# EAGLE design ADM3260_Breakout (EAGLE 9.2.2)
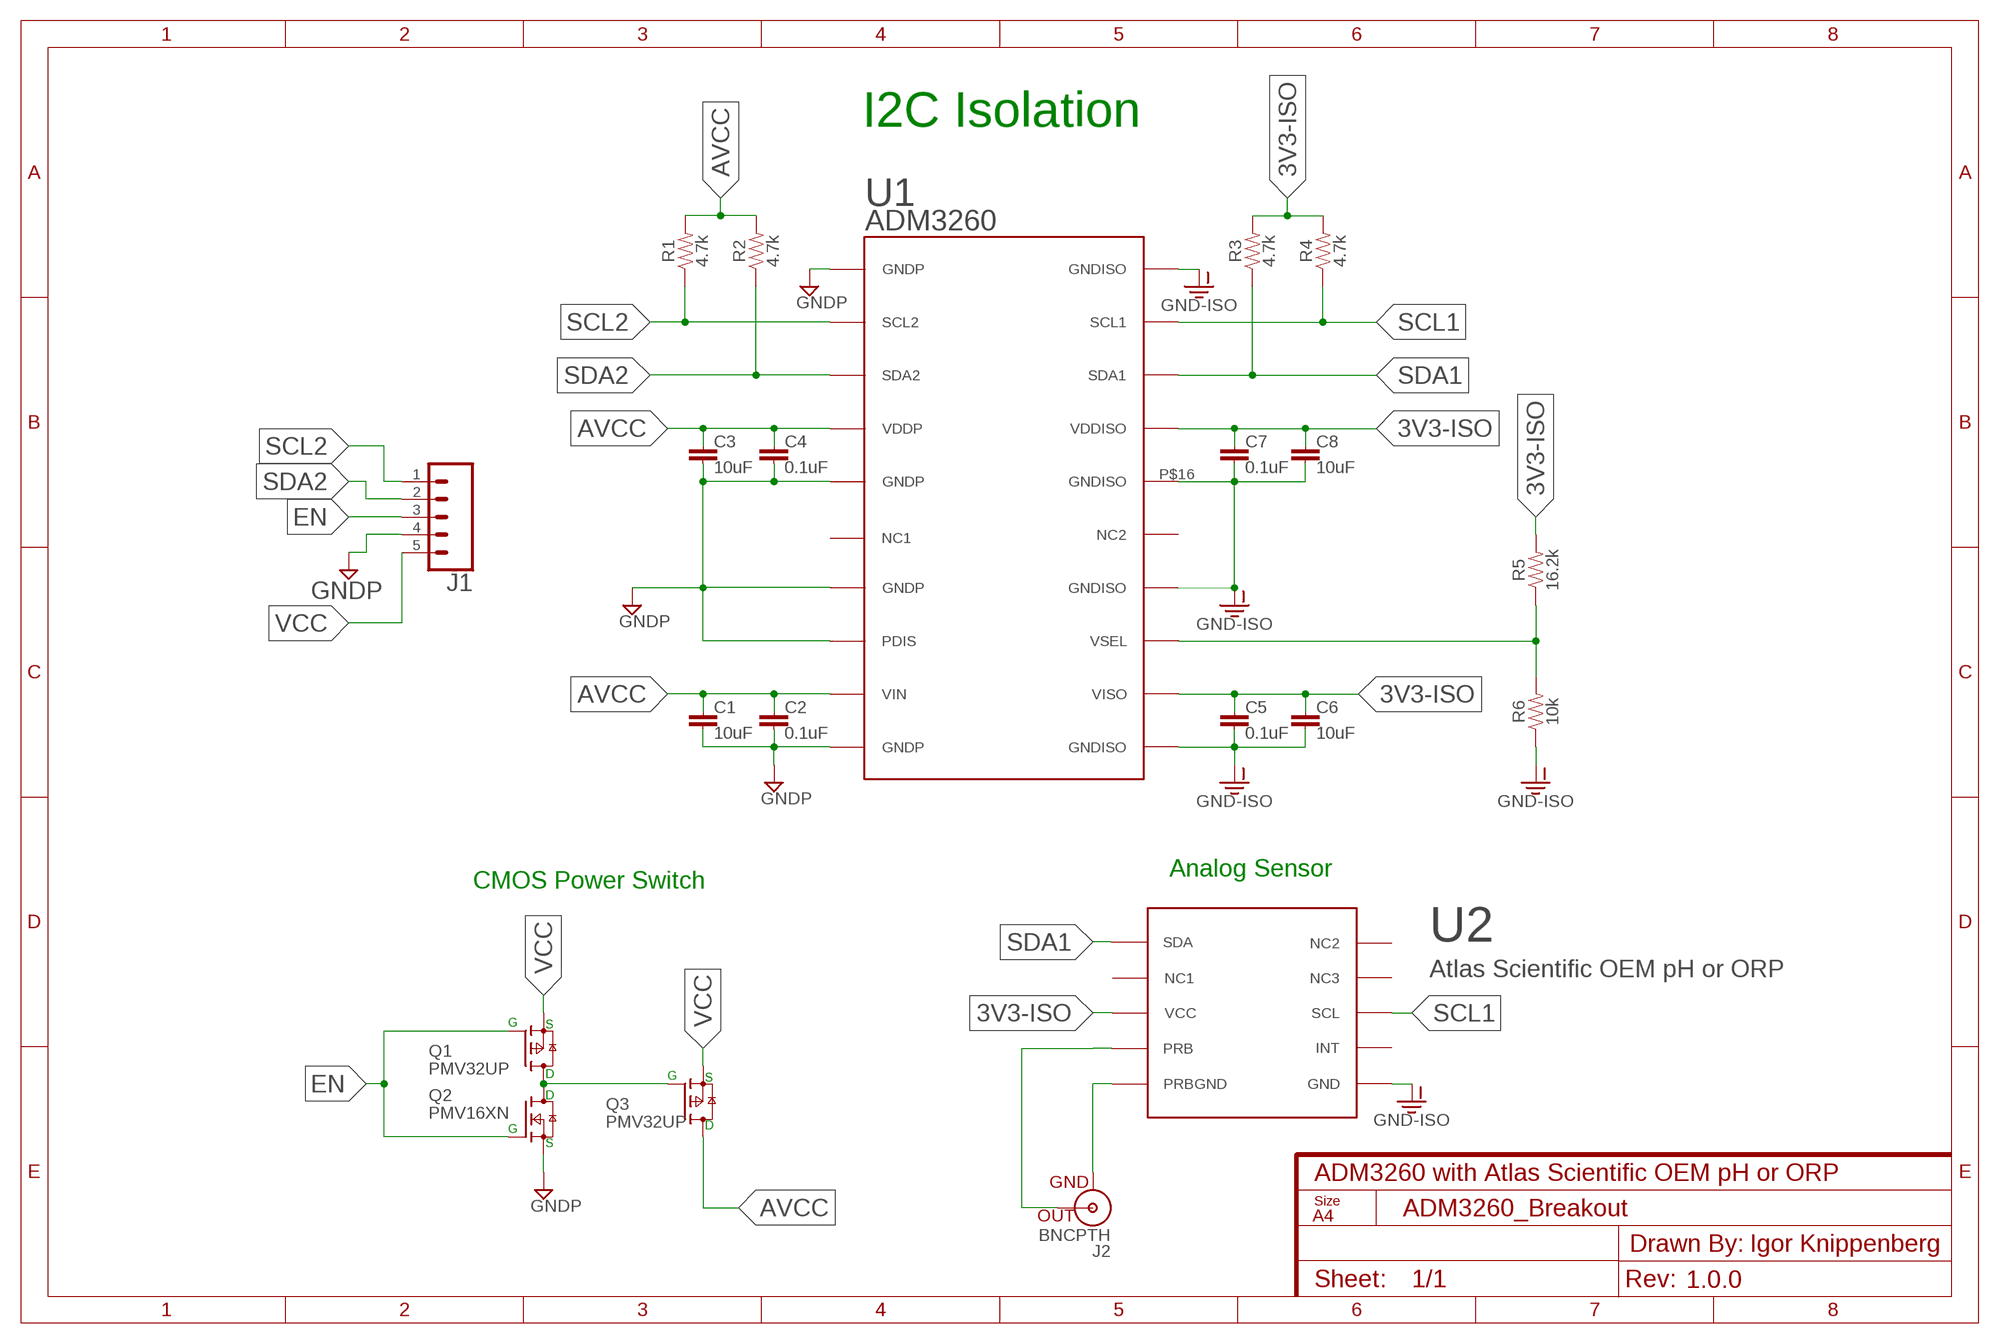
[diagram p0: schematic, sheet 1]
FRAME1 (FRAME-A4L): CNAME: ADM3260 with Atlas Scientific OEM pH or ORP; CREVISION: 1.0.0; DESIGNER: Igor Knippenberg

## Parts
C1  10uF  10UF-0805-10V-10%  [0805]
C2  0.1uF  0.1UF-0603-25V-(+80/-20%)  [0603]
C3  10uF  10UF-0805-10V-10%  [0805]
C4  0.1uF  0.1UF-0603-25V-(+80/-20%)  [0603]
C5  0.1uF  0.1UF-0603-25V-(+80/-20%)  [0603]
C6  10uF  10UF-0805-10V-10%  [0805]
C7  0.1uF  0.1UF-0603-25V-(+80/-20%)  [0603]
C8  10uF  10UF-0805-10V-10%  [0805]
J1  CONN_05LOCK_LONGPADS  [1X05_LOCK_LONGPADS]
J2  BNCPTH  [BNC]
Q1  PMV32UP  BSS84  [SOT23]
Q2  PMV16XN  BSH105  [SOT23]
Q3  PMV32UP  BSS84  [SOT23]
R1  4.7k  4.7KOHM-0603-1/10W-1%  [0603]
R2  4.7k  4.7KOHM-0603-1/10W-1%  [0603]
R3  4.7k  4.7KOHM-0603-1/10W-1%  [0603]
R4  4.7k  4.7KOHM-0603-1/10W-1%  [0603]
R5  16.2k  16.2KOHM-0603-1/10W-1%  [0603]
R6  10k  10KOHM-0603-1/10W-1%  [0603]
U1  ADM3260  [ADM3260]
U2  Atlas Scientific OEM pH or ORP  PHSENSOR  [PHSENSOR]

## Nets
3V3-ISO: C5.1 C6.1 C7.1 C8.1 R3.2 R4.2 R5.2 U1.P$12(VISO) U1.P$17(VDDISO) U2.P$3(VCC)
AVCC: C1.1 C2.1 C3.1 C4.1 Q3.3(D) R1.2 R2.2 U1.P$4(VDDP) U1.P$9(VIN)
EN: J1.3 Q1.1(G) Q2.1(G)
GND: C1.2 C2.2 C3.2 C4.2 J1.4 Q2.2(S) U1.P$1(GNDP) U1.P$5(GNDP) U1.P$7(GNDP) U1.P$8(PDIS) U1.P$10(GNDP) ; supply symbol labelled GNDP
GND-ISO: C5.2 C6.2 C7.2 C8.2 R6.1 U1.P$11(GNDISO) U1.P$14(GNDISO) U1.P$16(GNDISO) U1.P$20(GNDISO) U2.P$6(GND)
N$1: R5.1 R6.2 U1.P$13(VSEL)
N$2: Q1.3(D) Q2.3(D) Q3.1(G)
PRB: J2.S(OUT) U2.P$4(PRB)
PRBGND: J2.GND U2.P$5(PRBGND)
SCL1: R4.1 U1.P$19(SCL1) U2.P$8(SCL)
SCL2: J1.1 R1.1 U1.P$2(SCL2)
SDA1: R3.1 U1.P$18(SDA1) U2.P$1(SDA)
SDA2: J1.2 R2.1 U1.P$3(SDA2)
VCC: J1.5 Q1.2(S) Q3.2(S)
Unconnected: U1.P$6(NC1) U1.P$15(NC2) U2.P$2(NC1) U2.P$7(INT) U2.P$9(NC3) U2.P$10(NC2)

## Notes on the sheet
- I2C Isolation
- Analog Sensor
- CMOS Power Switch
- G | S
- D | G
- S
- D
- D
- G
- S

## Library data of the parts
C1 C3 C6 C8 = SparkFun-Capacitors:10UF: 10.0µF ceramic capacitors A capacitor is a passive two-terminal electrical component used to store electrical energy temporarily in an electric field.; PROD_ID: CAP-11330
C2 C4 C5 C7 = SparkFun-Capacitors:0.1UF: 0.1µF ceramic capacitors A capacitor is a passive two-terminal electrical component used to store electrical energy temporarily in an electric field.; PROD_ID: CAP-00810
J1 = SparkFun-Connectors:CONN_05: Multi connection point. Often used as Generic Header-pin footprint for 0.1 inch spaced/style header connections On any of the 0.1 inch spaced packages, you can populate with these: Break Away Headers - Straight <https://www.sparkfun.com/products/116> (PRT-00116) Break Away Male Headers - Right Angle <https://www.sparkfun.com/products/553> (PRT-00553) Female Headers <https://www.sparkfun.com/products/115> (PRT-00115) Break Away Headers - Machine Pin <https://www.sparkfun.com/products/117> (PRT-00117) Break Away Female Headers - Swiss Machine Pin <https://www.sparkfun.com/products/743> (PRT-00743) For SCREWTERMINALS and SPRING TERMINALS visit here: Screw Terimnals on SparkFun.com <https://www.sparkfun.com/search/results?term=Screw+Terminals> (5mm/3.5mm/2.54mm spacing) This device is also useful as a general connection point to wire up your design to another part of your project. Our various solder wires solder well into these plated through hole pads. Hook-Up Wire - Assortment (Stranded, 22 AWG) <https://www.sparkfun.com/products/11375> (PRT-11375) Hook-Up Wire - Assortment (Solid Core, 22 AWG) <https://www.sparkfun.com/products/11367> (PRT-11367) View the entire wire category on our website here <https://www.sparkfun.com/categories/141> Special notes: Molex polarized connector foot print use with SKU : PRT-08231 with associated crimp pins and housings. 1MM SMD Version SKU: PRT-10208
J2 = SparkFun-Connectors:BNC: BNC Right Angle Connector Mouser Part# 5227161 SparkFun Products: BNC Connector - Right Angle <https://www.sparkfun.com/products/10550>; PROD_ID: LPA-12729; SF_ID: PRT-10550
Q1 Q3 = nxp_60:BSS84: P-channel enhancement mode vertical DMOS transistor P-channel enhancement mode vertical Diffusion Metal-Oxide Semiconductor (DMOS) transistor in a small Surface-Mounted Device (SMD) plastic package. AAL Eindhoven MK
Q2 = nxp_60:BSH105: N-channel enhancement mode MOS transistor
R1-R4 = SparkFun-Resistors:4.7KOHM: 4.7kΩ resistor A resistor is a passive two-terminal electrical component that implements electrical resistance as a circuit element. Resistors act to reduce current flow, and, at the same time, act to lower voltage levels within circuits. - Wikipedia; PROD_ID: RES-07857
R5 = SparkFun-Resistors:16.2KOHM: 16.2kΩ resistor A resistor is a passive two-terminal electrical component that implements electrical resistance as a circuit element. Resistors act to reduce current flow, and, at the same time, act to lower voltage levels within circuits. - Wikipedia; PROD_ID: RES-12187
R6 = SparkFun-Resistors:10KOHM: 10kΩ resistor A resistor is a passive two-terminal electrical component that implements electrical resistance as a circuit element. Resistors act to reduce current flow, and, at the same time, act to lower voltage levels within circuits. - Wikipedia; PROD_ID: RES-00824
U1 = analog-devices:ADM3260: ADM3260 - I2C Isolator with DCDC Converter
U2 = SENSOR:PHSENSOR: pH OEM - Atlas Scientific pH Sensor Technical Specifications: Reads: pH Range: .001-14.000 Max rate: 1 reading every 420ms Operating Voltage: 3.3V - 5V

## Board
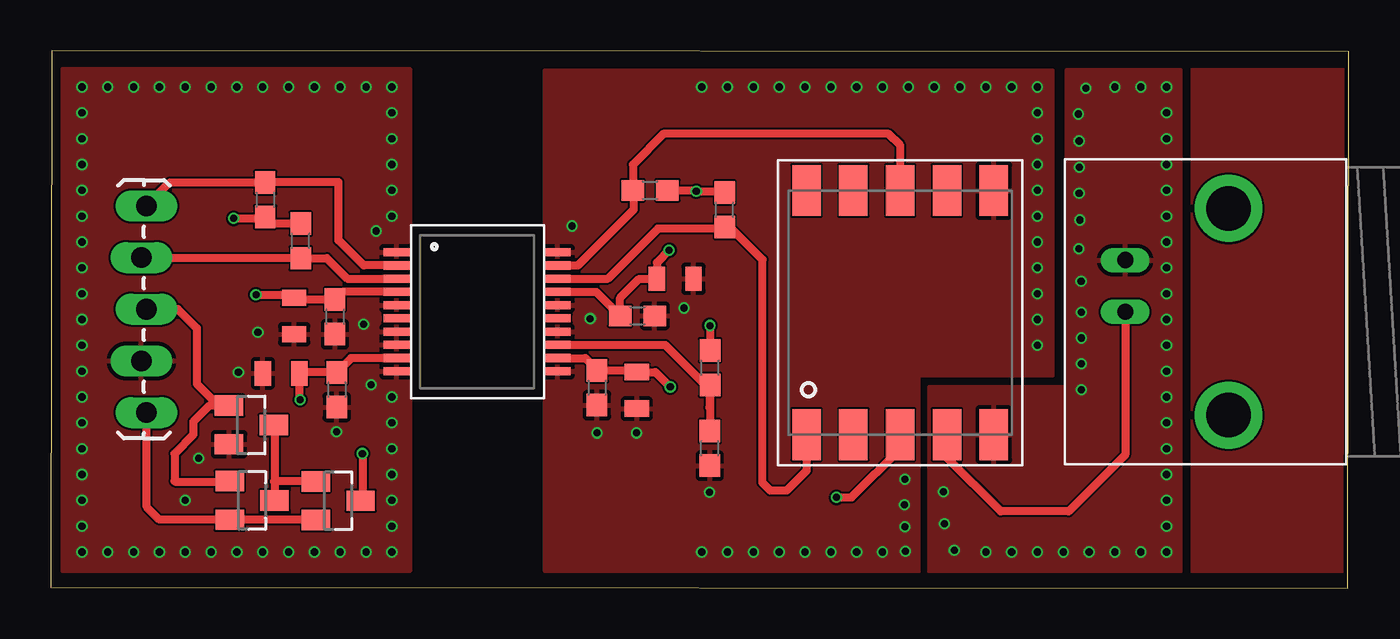
[diagram p1: board, top side]
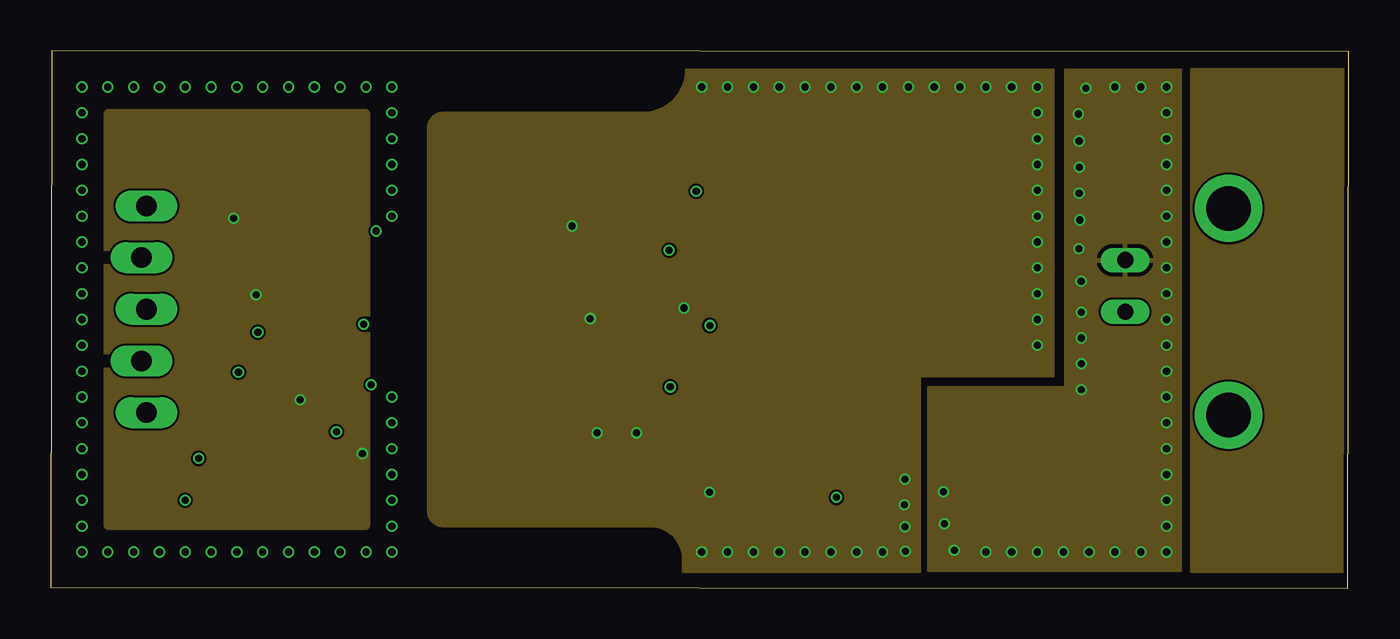
[diagram p2: board, inner layer Route2]
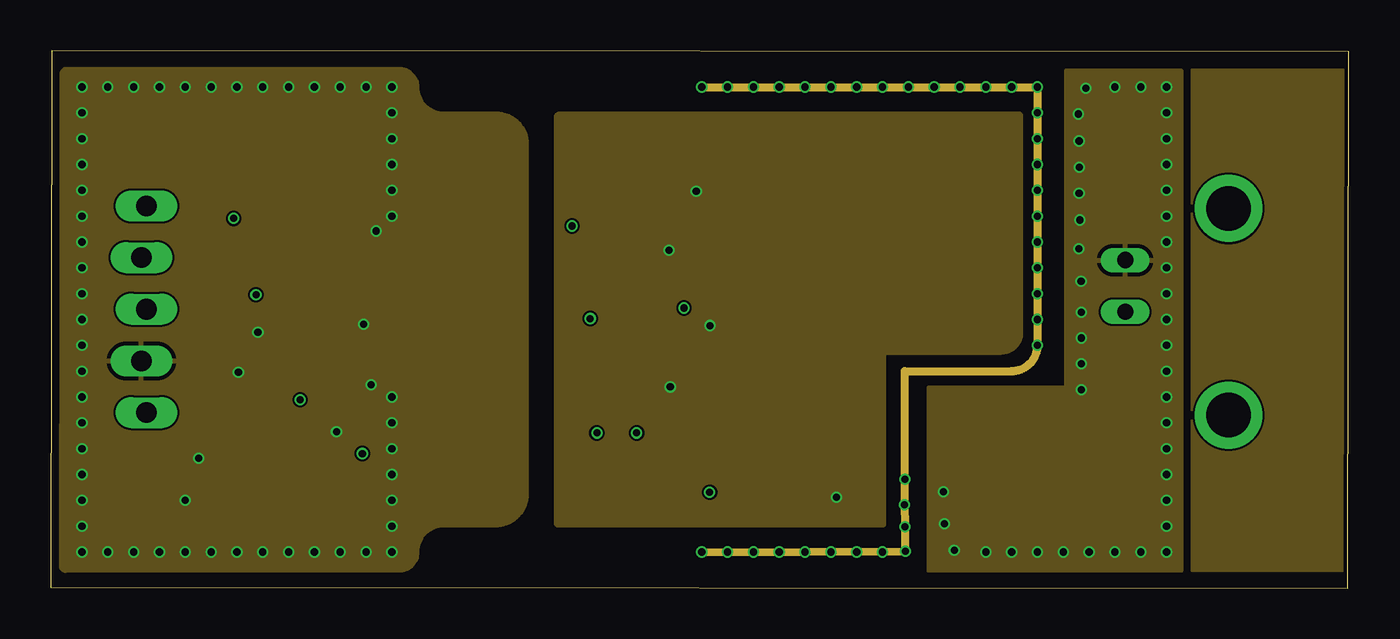
[diagram p3: board, inner layer Route3]
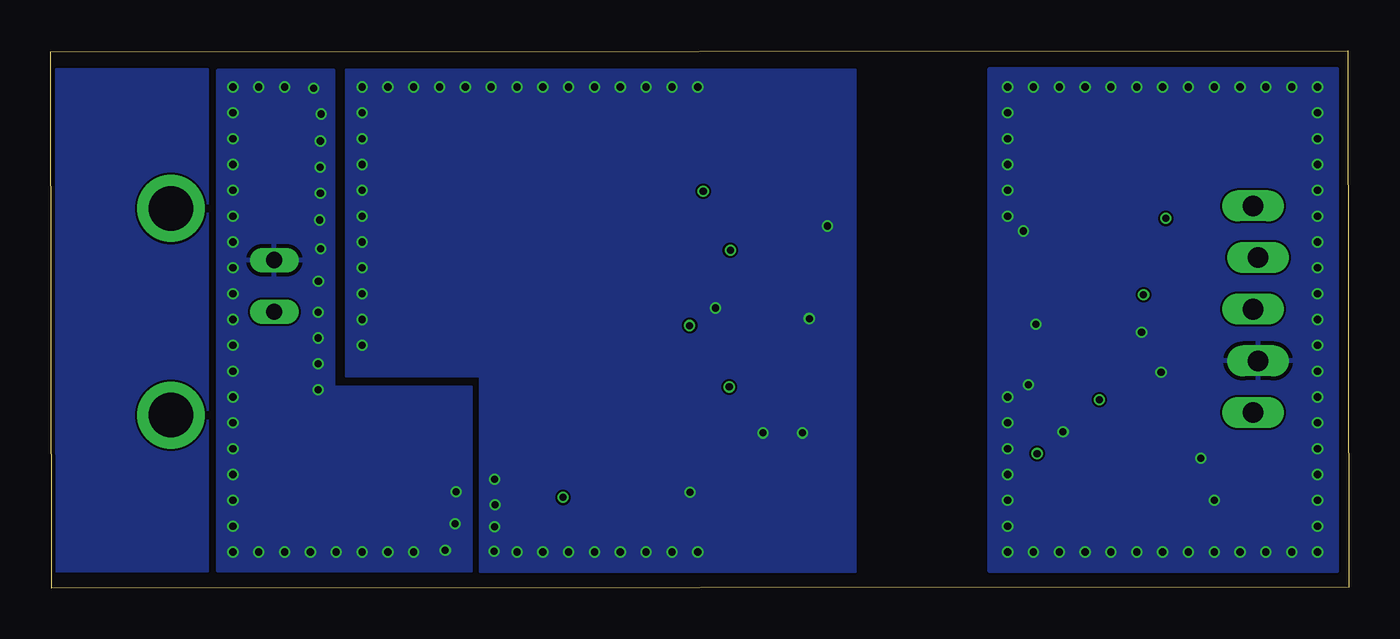
[diagram p4: board, bottom side, seen from below]

Size 63.82 x 26.41 mm. Coordinates in mm from the lower left corner, seen from the top.
Outline: 0,0.04 63.79,0 63.82,26.37 0.03,26.41 0,0.04
Copper layers (1+2*3+16): Top 0.018mm / dielectric 0.36mm / Route2 0.035mm / dielectric 0.71mm / Route3 0.035mm / dielectric 0.36mm / Bottom 0.018mm
Design rules "Multi-CB_4L_100µm-Tracks_OL35µm-IL35µm": minimum track width 0.1mm, minimum drill 0.2mm, track to track 0.1mm, track to pad 0.1mm, pad to pad 0.1mm, via to via 0.1mm, smd to smd 0mil, copper to edge 0.2mm, drill to drill 0.2mm, minimum pad ring 0.125mm, minimum via ring 0.1mm, stop-mask expansion 2mil, vias tented up to drill 0.45mm, thermal gap 0.2mm

### Footprints (pad centres in the part's own frame; a part is rotated, then mirrored left to right if it is on the bottom)
0805 = smd 0.8 x 1.2: 1 -0.9,0; 2 0.9,0
0603 = smd 1.1 x 1: 1 -0.85,0; 2 0.85,0
1X05_LOCK_LONGPADS = drill 1.016 long: 1 0,0; 2 2.54,-0.254; 3 5.08,0; 4 7.62,-0.254; 5 10.16,0
BNC = drill 2.2: 3 -5.08,5.08; 4 5.08,5.08 | drill 0.8 long: GND -2.54,0; S 0,0
SOT23 = smd 1 x 1.4: 1 -0.95,-1.1; 2 0.95,-1.1; 3 0,1.1
ADM3260 = smd 0.4 x 1.3: P$1 -2.925,-3.95; P$2 -2.275,-3.95; P$3 -1.625,-3.95; P$4 -0.975,-3.95; P$5 -0.325,-3.95; P$6 0.325,-3.95; P$7 0.975,-3.95; P$8 1.625,-3.95; P$9 2.275,-3.95; P$10 2.925,-3.95; P$11 2.925,3.95; P$12 2.275,3.95; P$13 1.625,3.95; P$14 0.975,3.95; P$15 0.325,3.95; P$16 -0.325,3.95; P$17 -0.975,3.95; P$18 -1.625,3.95; P$19 -2.275,3.95; P$20 -2.925,3.95
PHSENSOR = smd 2.5 x 1.4: P$1 -6,4.6; P$2 -6,2.3; P$3 -6,0; P$4 -6,-2.3; P$5 -6,-4.6; P$6 6,-4.6; P$7 6,-2.3; P$8 6,0; P$9 6,2.3; P$10 6,4.6

### Placement (x,y rotation side)
C1  11.32,10.55 180 top
C2  14.06,9.75 270 top
C3  11.96,13.37 270 top
C4  13.97,13.34 270 top
C5  26.85,9.85 270 top
C6  28.81,9.72 270 top
C7  28.85,13.38 0 top
C8  30.7,15.2 0 top
J1  4.7,18.79 270 top
J2  52.84,13.58 270 top
Q1  9.9,4.31 270 top
Q2  9.86,8.02 270 top
Q3  14.13,4.29 270 top
R1  10.54,19.09 270 top
R2  12.29,17.07 90 top
R3  33.14,18.6 90 top
R4  29.47,19.55 0 top
R5  32.42,10.84 90 top
R6  32.41,6.87 90 top
U1  20.96,13.58 270 top
U2  41.77,13.54 90 top

### Tracks (layer width: path | path; a pad name or v marks a point on that pad's centre or on a via)
3V3-ISO  (via drill 0.35)
  Top 0.381: 26.92,10.76 26.87,10.72 | 26.87,10.72 C5.1 28.74,10.7 C6.1 29.72,10.62 v30.46,9.89 | U1.P$17 26.82,14.56 C7.1 28,14.27 28.93,15.2 C8.1 29.8,16 v30.41,16.6 | v32.41,12.9 32.42,12.89 R5.2 | U2.P$3 41.77,6.85 39.37,4.46 v38.64,4.46 | R4.2 31.7,19.55 v31.74,19.51 33.07,19.51 R3.2 | U1.P$12 26.28,11.31 26.87,10.72
  pour Route3: 47.63,23.23 25.04,23.23 arc90 24.92,23.11 24.92,3.18 40.9,3.18 40.9,11.68 46.74,11.68 arc90 47.63,12.56
AVCC  (via drill 0.35)
  Top 0.381: R2.2 10.86,17.92 R1.2 10.47,18.17 v8.99,18.17 | v12.27,9.26 12.22,9.3 C1.1 12.27,10.6 C2.1 14.77,11.31 U1.P$9 | U1.P$4 14.34,14.56 C4.1 12.05,14.19 C3.1 11.82,14.42 v10.09,14.42 | v15.32,6.61 15.32,4.38 Q3.3
  pour Route2: 2.8,23.36 15.5,23.36 15.5,3.04 2.8,3.04
BNC_PLANE
  pour Bottom: 56.1,25.49 56.1,0.82 63.56,0.82 63.56,25.49
  pour Top: 56.1,25.49 56.1,0.81 63.63,0.81 63.63,25.49
  pour Route2: 56.09,25.49 63.55,25.49 63.55,0.8 56.09,0.8
  pour Route3: 56.1,23.75 56.1,25.48 63.56,25.48 63.56,0.85 56.1,0.85 56.1,23.75
EN
  Top 0.381: J1.3 6.25,13.71 7.18,12.78 7.18,10.04 8.25,8.97 Q2.1 7.79,8.97 7.01,8.19 7.01,7.54 6.08,6.61 6.08,5.25 6.1,5.23 8.77,5.23 Q1.1
GND  (via drill 0.35)
  other vias: 1.53,1.77 7.88,1.77 2.8,1.77 4.07,1.77 5.34,1.77 6.61,1.77 9.15,1.77 10.42,1.77 11.69,1.77 12.96,1.77 14.23,1.77 15.5,1.77 16.77,1.77 15.76,10 16.77,9.39 16.77,8.12 16.77,6.85 16.77,5.58 16.77,4.31 16.77,3.04 1.53,3.04 1.53,4.31 1.53,5.58 1.53,6.85 1.53,8.12 1.53,9.39 1.53,10.66 1.53,11.93 1.53,13.2 1.53,14.47 1.53,15.74 1.53,17.01 1.53,18.28 1.53,19.55 1.53,20.82 1.53,22.09 1.53,23.36 1.53,24.63 2.8,24.63 4.07,24.63 5.34,24.63 6.61,24.63 7.88,24.63 9.15,24.63 10.42,24.63 11.69,24.63 12.96,24.63 14.23,24.63 15.5,24.63 16.77,24.63 16.77,23.36 16.77,22.09 16.77,20.82 16.77,19.55 16.77,18.28 16,17.55 14.05,7.69 9.22,10.61 15.38,12.96 10.18,12.57 7.26,6.38 6.61,4.31
  pour Top: 17.66,25.52 17.66,0.83 0.58,0.83 0.58,25.52
  pour Bottom: 0.57,25.52 0.57,0.83 17.66,0.83 17.66,25.52
  pour Route3: 0.52,13.87 0.52,25.31 arc-90 0.77,25.56 2.05,25.56 17.11,25.56 arc-90 18.04,24.63 arc90 19.31,23.36 21.91,23.36 arc-90 23.42,21.85 23.42,4.61 arc-90 21.85,3.04 19.31,3.04 arc90 18.04,1.77 18.04,1.74 arc-90 17.11,0.82 0.73,0.82 arc-90 0.48,1.07 0.48,1.68 0.52,14.51
GND-ISO  (via drill 0.35)
  Route3 0.381: v32.01,1.77 v42.03,1.81 v42,5.36 arc90 v42,5.36 42,10.66 | v32.01,24.63 v48.52,24.63 v48.52,11.93 arc-90 47.25,10.66 42,10.66 | 42,10.66 arc90 42,10.66 | 42,10.66 arc90 42,10.66
  other vias: 33.28,1.77 34.55,1.77 35.82,1.77 37.09,1.77 38.36,1.77 39.63,1.77 40.9,1.77 42,3.01 41.98,4.1 48.52,14.47 48.52,15.74 48.52,17.01 48.52,18.28 48.52,19.55 48.52,20.82 48.52,22.09 48.52,23.36 47.25,24.63 45.98,24.63 44.71,24.63 43.44,24.63 42.17,24.63 40.9,24.63 39.63,24.63 38.36,24.63 37.09,24.63 35.82,24.63 34.55,24.63 33.28,24.63 26.85,7.63 28.81,7.63 32.4,4.72 26.53,13.25 31.14,13.77 25.63,17.8 48.52,13.2
  pour Top: 24.26,25.47 24.26,0.82 42.71,0.82 42.71,10.43 49.29,10.43 49.29,25.47
  pour Route2: 31.25,25.48 49.3,25.48 49.3,10.41 42.73,10.41 42.73,0.81 31.09,0.81 31.09,1.42 arc90 29.47,3.04 19.3,3.04 arc-90 18.56,3.79 18.56,22.61 arc-90 19.31,23.36 29.13,23.36 arc90
  pour Bottom: 24.25,25.48 24.25,0.81 42.73,0.81 42.73,10.42 49.3,10.42 49.3,25.48
N$1
  Top 0.381: R5.1 32.42,8.91 | 32.42,8.91 32.42,7.73 R6.2 | U1.P$13 30.21,11.96 32.38,9.78 32.38,8.88 32.42,8.91
N$2
  Top 0.152: 10.96,5.24 Q2.3 11,7.98
  Top 0.381: Q3.1 10.96,5.24 | 11,7.98 Q1.3
PRB
  Top 0.152: 44.07,6.41 U2.P$4
  Top 0.381: J2.S 52.84,6.55 50.06,3.77 46.71,3.77 44.07,6.41
PRBGND  (via drill 0.35)
  other vias: 50.68,11.02 43.9,4.73 43.95,3.16 44.43,1.85 45.98,1.77 47.25,1.77 48.52,1.77 49.79,1.77 51.06,1.77 52.33,1.77 53.6,1.77 50.89,24.57 50.54,23.31 50.57,21.98 50.58,20.68 50.57,19.41 50.6,18.1 50.56,16.68 50.67,15.08 50.68,13.56 50.68,12.29 50.68,9.75 54.87,1.77 54.87,3.04 54.87,4.31 54.87,5.58 54.87,6.85 54.87,8.12 54.87,9.39 54.87,10.66 54.87,11.93 54.87,13.2 54.87,14.47 54.87,15.74 54.87,17.01 54.87,18.28 54.87,19.55 54.87,20.82 54.87,22.09 54.87,23.36 54.87,24.63 53.6,24.63 52.33,24.63
  pour Top: 43.16,9.9 43.16,0.82 55.61,0.82 55.61,25.48 49.91,25.48 49.91,9.9
  pour Route2: 43.14,0.85 43.14,9.87 49.89,9.87 49.89,25.49 55.58,25.49 55.58,0.85
  pour Bottom: 49.91,25.48 49.91,9.9 43.15,9.9 43.15,0.82 55.61,0.82 55.61,25.48
  pour Route3: 49.93,11.93 49.93,25.45 55.58,25.45 55.58,0.84 43.18,0.84 43.18,9.87 49.93,9.87 49.94,11.91 49.94,11.91
SCL1
  Top 0.152: R4.1 28.66,19.51
  Top 0.381: U1.P$19 25.92,15.86 28.66,18.61 28.66,19.51 | U2.P$8 41.77,21.76 41.2,22.33 30.13,22.33 28.62,20.82 R4.1
SCL2
  Top 0.381: J1.1 5.85,19.94 R1.1 10.56,19.96 14.15,19.96 14.15,17.09 15.38,15.86 U1.P$2
SDA1
  Top 0.381: U1.P$18 27.4,15.21 29.85,17.67 33.06,17.67 R3.1 33.4,17.75 35,16.15 34.99,16.14 34.99,5.19 35.39,4.79 36.18,4.79 37.17,5.77 U2.P$1
SDA2
  Top 0.381: J1.2 12.25,16.25 R2.1 13.57,16.22 14.57,15.21 U1.P$3
VCC
  Top 0.152: Q3.2 13.01,3.36
  Top 0.381: 13.01,3.36 Q1.2 5.34,3.36 4.73,3.98 4.73,8.61 J1.5